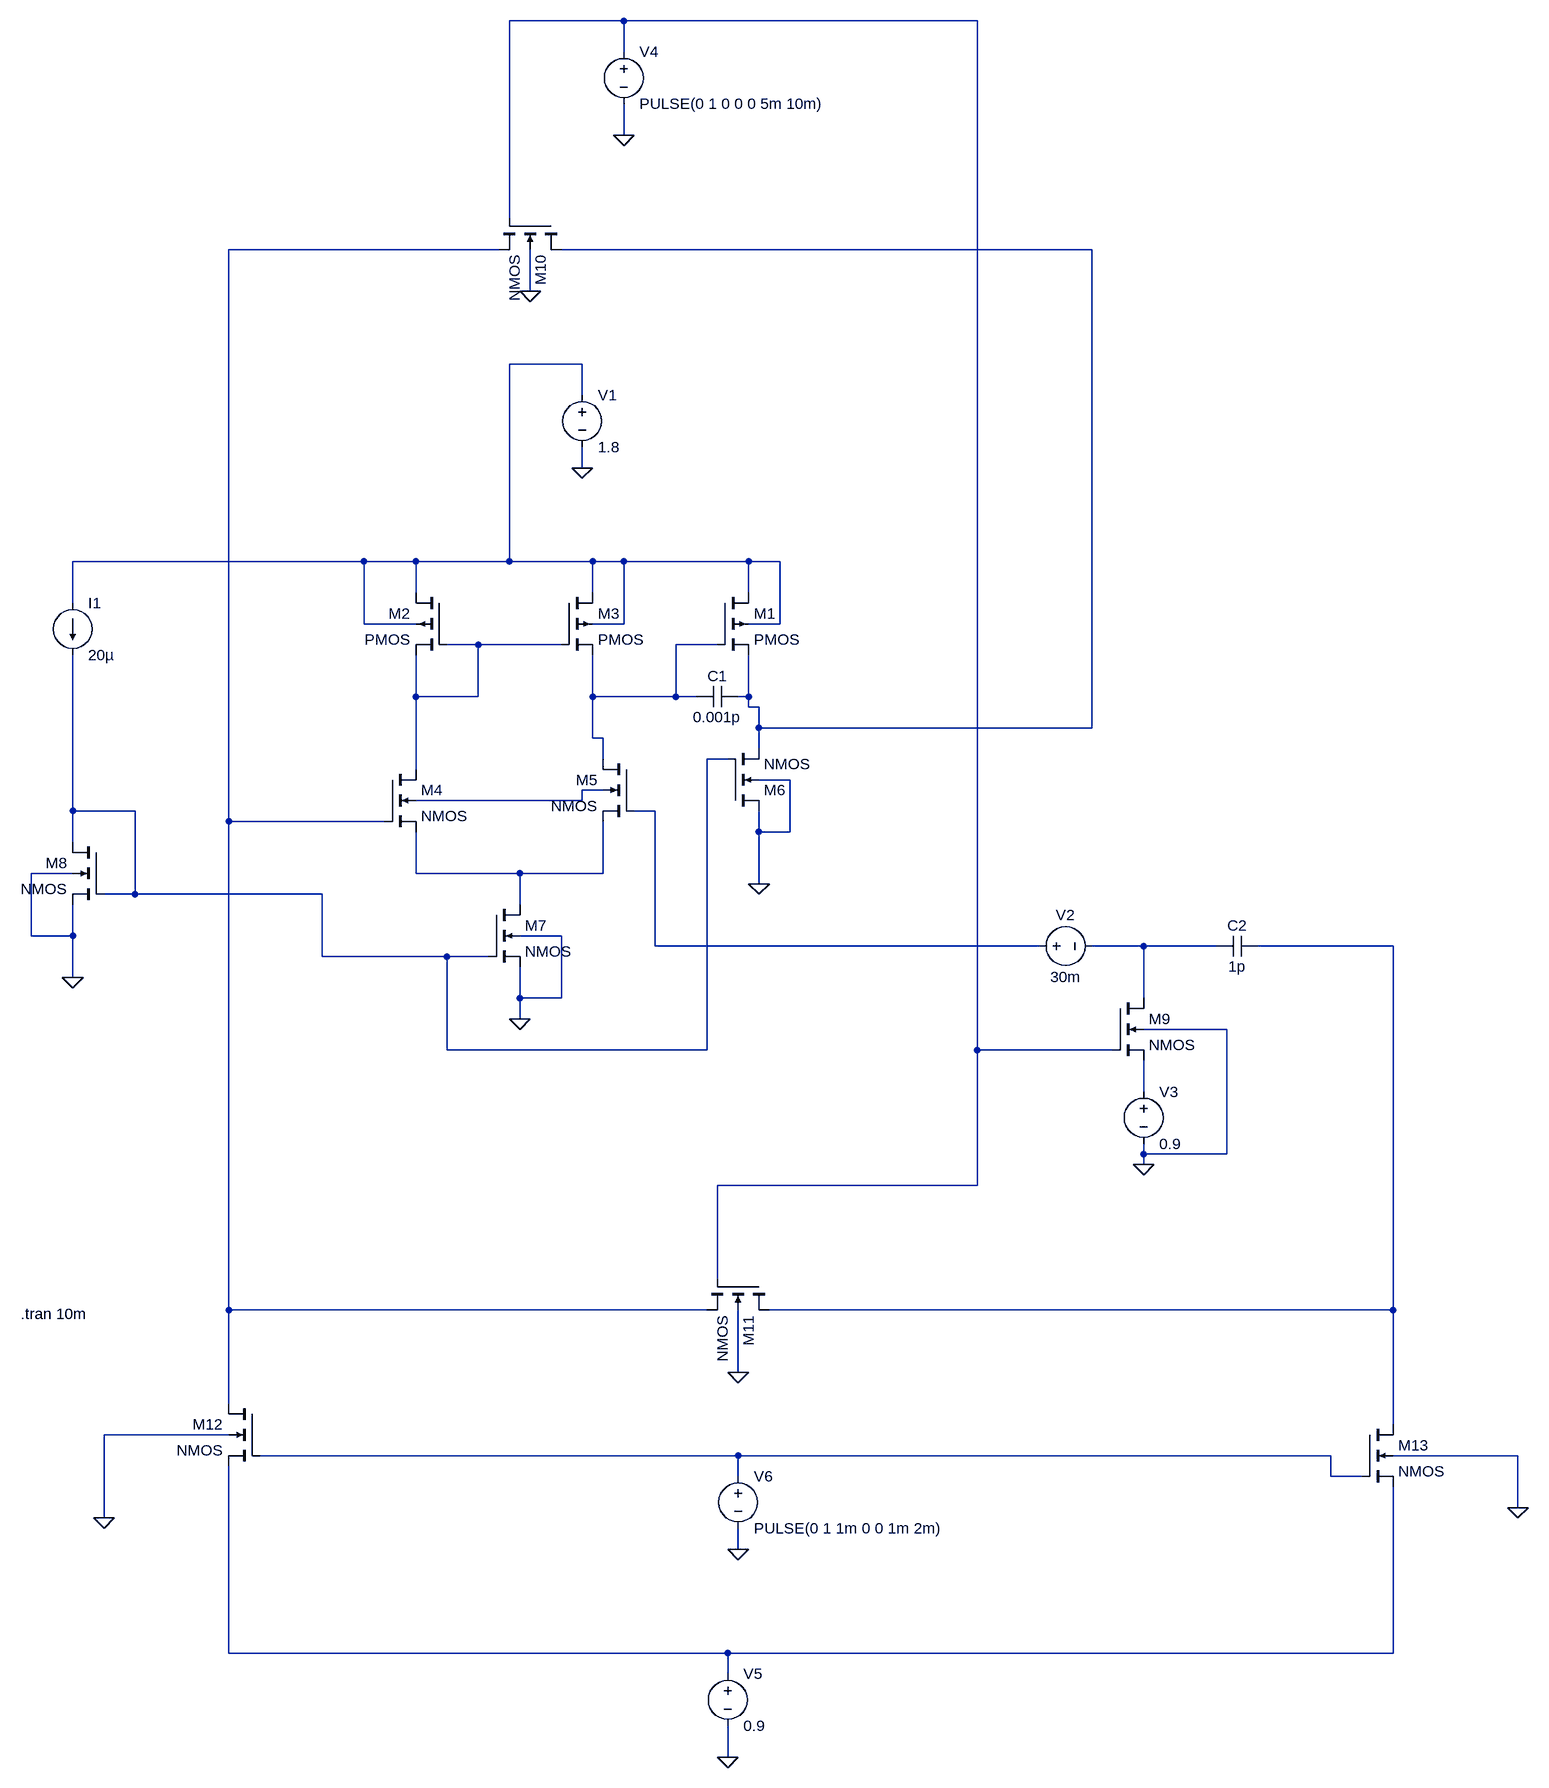
[diagram p0: schematic offset_cancellation.asc]
offset_cancellation.asc, the LTspice schematic file:
Version 4
SHEET 1 1636 1860
WIRE 240 -832 64 -832
WIRE 784 -832 240 -832
WIRE 240 -784 240 -832
WIRE 240 -656 240 -704
WIRE 64 -528 64 -832
WIRE 48 -480 -368 -480
WIRE 960 -480 144 -480
WIRE 96 -416 96 -480
WIRE 176 -304 64 -304
WIRE 176 -256 176 -304
WIRE 176 -144 176 -176
WIRE -160 0 -608 0
WIRE -80 0 -160 0
WIRE 64 0 64 -304
WIRE 64 0 -80 0
WIRE 192 0 64 0
WIRE 240 0 192 0
WIRE 432 0 240 0
WIRE 480 0 432 0
WIRE -80 48 -80 0
WIRE 192 48 192 0
WIRE 432 48 432 0
WIRE -608 64 -608 0
WIRE -160 96 -160 0
WIRE -80 96 -160 96
WIRE 240 96 240 0
WIRE 240 96 192 96
WIRE 480 96 480 0
WIRE 480 96 432 96
WIRE 16 128 -32 128
WIRE 144 128 16 128
WIRE 384 128 320 128
WIRE -80 208 -80 144
WIRE 16 208 16 128
WIRE 16 208 -80 208
WIRE 192 208 192 144
WIRE 320 208 320 128
WIRE 320 208 192 208
WIRE 352 208 320 208
WIRE 432 208 432 144
WIRE 432 208 416 208
WIRE 432 224 432 208
WIRE 448 224 432 224
WIRE 448 256 448 224
WIRE 960 256 960 -480
WIRE 960 256 448 256
WIRE 192 272 192 208
WIRE 208 272 192 272
WIRE 448 288 448 256
WIRE 208 304 208 272
WIRE 400 304 368 304
WIRE -80 320 -80 208
WIRE 496 336 448 336
WIRE 208 352 176 352
WIRE 176 368 176 352
WIRE 176 368 -80 368
WIRE -608 384 -608 144
WIRE -512 384 -608 384
WIRE 288 384 256 384
WIRE -368 400 -368 -480
WIRE -128 400 -368 400
WIRE 448 416 448 384
WIRE 496 416 496 336
WIRE 496 416 448 416
WIRE -608 432 -608 384
WIRE -608 480 -672 480
WIRE -80 480 -80 416
WIRE 80 480 -80 480
WIRE 208 480 208 400
WIRE 208 480 80 480
WIRE 448 496 448 416
WIRE -512 512 -512 384
WIRE -512 512 -560 512
WIRE -224 512 -512 512
WIRE 80 528 80 480
WIRE -672 576 -672 480
WIRE -608 576 -608 528
WIRE -608 576 -672 576
WIRE 144 576 80 576
WIRE 288 592 288 384
WIRE 880 592 288 592
WIRE 1040 592 960 592
WIRE 1152 592 1040 592
WIRE 1424 592 1216 592
WIRE -224 608 -224 512
WIRE -32 608 -224 608
WIRE 32 608 -32 608
WIRE -608 640 -608 576
WIRE 80 672 80 624
WIRE 144 672 144 576
WIRE 144 672 80 672
WIRE 1040 672 1040 592
WIRE 80 704 80 672
WIRE 1168 720 1040 720
WIRE -32 752 -32 608
WIRE 368 752 368 304
WIRE 368 752 -32 752
WIRE 784 752 784 -832
WIRE 992 752 784 752
WIRE 1040 816 1040 768
WIRE 1040 912 1040 896
WIRE 1168 912 1168 720
WIRE 1168 912 1040 912
WIRE 1040 928 1040 912
WIRE 784 960 784 752
WIRE 784 960 384 960
WIRE 384 1104 384 960
WIRE -368 1152 -368 400
WIRE 368 1152 -368 1152
WIRE 1424 1152 1424 592
WIRE 1424 1152 464 1152
WIRE 416 1248 416 1152
WIRE -368 1296 -368 1152
WIRE 1424 1328 1424 1152
WIRE -368 1344 -560 1344
WIRE 416 1376 -320 1376
WIRE 1328 1376 416 1376
WIRE 1616 1376 1424 1376
WIRE 416 1408 416 1376
WIRE 1328 1408 1328 1376
WIRE 1376 1408 1328 1408
WIRE 1616 1456 1616 1376
WIRE -560 1472 -560 1344
WIRE 416 1520 416 1488
WIRE -368 1680 -368 1392
WIRE 400 1680 -368 1680
WIRE 1424 1680 1424 1424
WIRE 1424 1680 400 1680
WIRE 400 1712 400 1680
WIRE 400 1840 400 1792
FLAG 80 704 0
FLAG 448 496 0
FLAG -608 640 0
FLAG 176 -144 0
FLAG 1040 928 0
FLAG 96 -416 0
FLAG 240 -656 0
FLAG 416 1248 0
FLAG 400 1840 0
FLAG -560 1472 0
FLAG 1616 1456 0
FLAG 416 1520 0
SYMBOL pmos4 384 48 R0
SYMATTR InstName M1
SYMATTR Value2 l=1u w=10u
SYMBOL pmos4 -32 48 M0
SYMATTR InstName M2
SYMATTR Value2 l=1u w=10u
SYMBOL pmos4 144 48 R0
SYMATTR InstName M3
SYMATTR Value2 l=1u w=10u
SYMBOL nmos4 -128 320 R0
SYMATTR InstName M4
SYMATTR Value2 l=2u w=20u
SYMBOL nmos4 256 304 M0
SYMATTR InstName M5
SYMATTR Value2 l=2u w=20u
SYMBOL nmos4 400 384 M180
SYMATTR InstName M6
SYMATTR Value2 l=5u w=10u
SYMBOL nmos4 32 528 R0
SYMATTR InstName M7
SYMATTR Value2 l=5u w=10u
SYMBOL cap 416 192 R90
WINDOW 0 0 32 VBottom 2
WINDOW 3 32 32 VTop 2
SYMATTR InstName C1
SYMATTR Value 0.001p
SYMBOL current -608 64 R0
WINDOW 123 0 0 Left 2
WINDOW 39 0 0 Left 2
SYMATTR InstName I1
SYMATTR Value 20µ
SYMBOL nmos4 -560 432 M0
SYMATTR InstName M8
SYMATTR Value2 l=5u w=10u
SYMBOL voltage 176 -272 R0
WINDOW 123 0 0 Left 2
WINDOW 39 0 0 Left 2
SYMATTR InstName V1
SYMATTR Value 1.8
SYMBOL voltage 864 592 R270
WINDOW 0 32 56 VTop 2
WINDOW 3 -32 56 VBottom 2
WINDOW 123 0 0 Left 2
WINDOW 39 0 0 Left 2
SYMATTR InstName V2
SYMATTR Value 30m
SYMBOL cap 1216 576 R90
WINDOW 0 0 32 VBottom 2
WINDOW 3 32 32 VTop 2
SYMATTR InstName C2
SYMATTR Value 1p
SYMBOL voltage 1040 800 R0
WINDOW 123 0 0 Left 2
WINDOW 39 0 0 Left 2
SYMATTR InstName V3
SYMATTR Value 0.9
SYMBOL nmos4 992 672 R0
SYMATTR InstName M9
SYMATTR Value2 l=1u w=10u
SYMBOL nmos4 144 -528 R90
SYMATTR InstName M10
SYMATTR Value2 l=1u w=10u
SYMBOL voltage 240 -800 R0
WINDOW 123 0 0 Left 2
WINDOW 39 0 0 Left 2
SYMATTR InstName V4
SYMATTR Value PULSE(0 1 0 0 0 5m 10m)
SYMBOL nmos4 464 1104 R90
SYMATTR InstName M11
SYMATTR Value2 l=1u w=10u
SYMBOL voltage 400 1696 R0
WINDOW 123 0 0 Left 2
WINDOW 39 0 0 Left 2
SYMATTR InstName V5
SYMATTR Value 0.9
SYMBOL nmos4 -320 1296 M0
SYMATTR InstName M12
SYMATTR Value2 l=1u w=10u
SYMBOL nmos4 1376 1328 R0
SYMATTR InstName M13
SYMATTR Value2 l=1u w=10u
SYMBOL voltage 416 1392 R0
WINDOW 123 0 0 Left 2
WINDOW 39 0 0 Left 2
SYMATTR InstName V6
SYMATTR Value PULSE(0 1 1m 0 0 1m 2m)
TEXT -688 1158 Left 2 !.tran 10m

The netlist it stands for:
* offset_cancellation.asc
M1 N004 N006 N003 N004 PMOS l=1u w=10u
M2 N004 N005 N005 N004 PMOS l=1u w=10u
M3 N004 N005 N006 N004 PMOS l=1u w=10u
M4 N005 N002 N010 N008 NMOS l=2u w=20u
M5 N006 N009 N010 N008 NMOS l=2u w=20u
M6 0 N007 N003 0 NMOS l=5u w=10u
M7 N010 N007 0 0 NMOS l=5u w=10u
C1 N003 N006 0.001p
I1 N004 N007 20µ
M8 N007 N007 0 0 NMOS l=5u w=10u
V1 N004 0 1.8
V2 N009 N011 30m
C2 N012 N011 1p
V3 N013 0 0.9
M9 N011 N001 N013 0 NMOS l=1u w=10u
M10 N003 N001 N002 0 NMOS l=1u w=10u
V4 N001 0 PULSE(0 1 0 0 0 5m 10m)
M11 N012 N001 N002 0 NMOS l=1u w=10u
V5 N015 0 0.9
M12 N002 N014 N015 0 NMOS l=1u w=10u
M13 N012 N014 N015 0 NMOS l=1u w=10u
V6 N014 0 PULSE(0 1 1m 0 0 1m 2m)
.model NMOS NMOS
.model PMOS PMOS
.lib standard.mos
.tran 10m
.backanno
.end